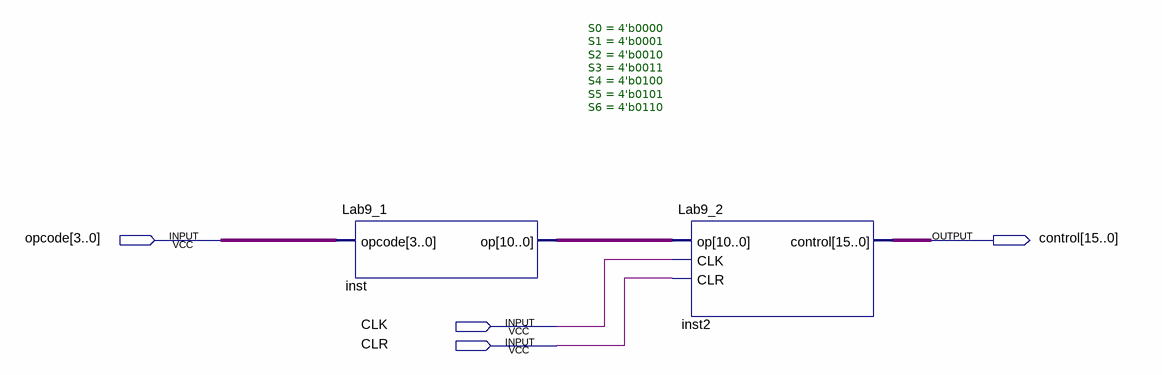
[diagram p0: schematic sheet]
// Quartus schematic Lab9.bdf as structural Verilog: 2 symbols, 4 pins
module Lab9 (
  input  [3:0] opcode,
  input  CLK,
  input  CLR,
  output [15:0] control
);

  wire [10:0] inst_op;

  Lab9_1 inst (.opcode(opcode), .op(inst_op));
  Lab9_2 #(.S0(4'b0000), .S1(4'b0001), .S2(4'b0010), .S3(4'b0011), .S4(4'b0100), .S5(4'b0101), .S6(4'b0110)) inst2 (
    .op(inst_op), .CLK(CLK), .CLR(CLR), .control(control));
endmodule
